# Altium schematic sheet 17.LPDDR4_LPDDR4x_1.SchDoc
size A4; SheetNumber: 17; SheetTotal: 21
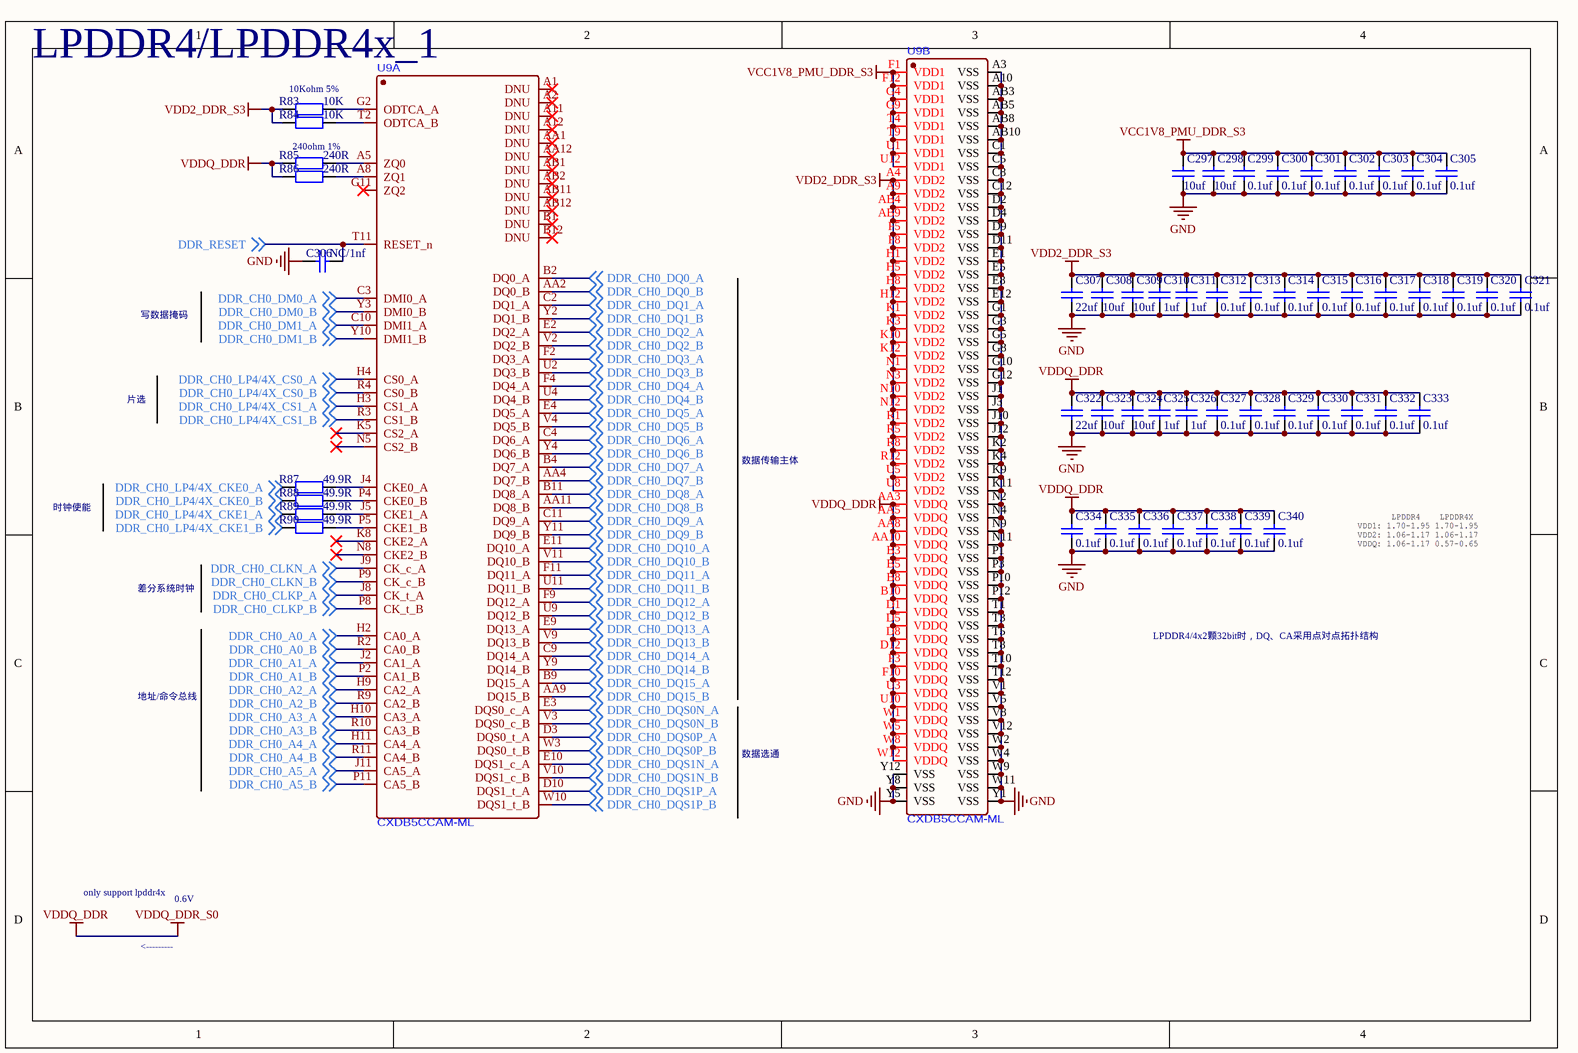
[diagram p0: 17.LPDDR4_LPDDR4x_1.SchDoc]

## Parts
C297  10uf  [C0402_L]
C298  10uf  [C0402_L]
C299  0.1uf  [C0201_L]
C300  0.1uf  [C0201_L]
C301  0.1uf  [C0201_L]
C302  0.1uf  [C0201_L]
C303  0.1uf  [C0201_L]
C304  0.1uf  [C0201_L]
C305  0.1uf  [C0201_L]
C306  NC/1nf  [C0201_L]
C307  22uf  [C0603_L]
C308  10uf  [C0402_L]
C309  10uf  [C0402_L]
C310  1uf  [C0201_L]
C311  1uf  [C0201_L]
C312  0.1uf  [C0201_L]
C313  0.1uf  [C0201_L]
C314  0.1uf  [C0201_L]
C315  0.1uf  [C0201_L]
C316  0.1uf  [C0201_L]
C317  0.1uf  [C0201_L]
C318  0.1uf  [C0201_L]
C319  0.1uf  [C0201_L]
C320  0.1uf  [C0201_L]
C321  0.1uf  [C0201_L]
C322  22uf  [C0603_L]
C323  10uf  [C0402_L]
C324  10uf  [C0402_L]
C325  1uf  [C0201_L]
C326  1uf  [C0201_L]
C327  0.1uf  [C0201_L]
C328  0.1uf  [C0201_L]
C329  0.1uf  [C0201_L]
C330  0.1uf  [C0201_L]
C331  0.1uf  [C0201_L]
C332  0.1uf  [C0201_L]
C333  0.1uf  [C0201_L]
C334  0.1uf  [C0201_L]
C335  0.1uf  [C0201_L]
C336  0.1uf  [C0201_L]
C337  0.1uf  [C0201_L]
C338  0.1uf  [C0201_L]
C339  0.1uf  [C0201_L]
C340  0.1uf  [C0201_L]
R83  10K  [R0201_L]
R84  10K  [R0201_L]
R85  240R  [R0201_L]
R86  240R  [R0201_L]
R87  49.9R  [R0201_L]
R88  49.9R  [R0201_L]
R89  49.9R  [R0201_L]
R90  49.9R  [R0201_L]
U9  CXDB5CCAM-ML  [FBGA-200_L15.0-W10.0-BL_K4F6E3S4HM]  (parts A,B of 2)

## Nets
GND: C297.1 C298.1 C299.1 C300.1 C301.1 C302.1 C303.1 C304.1 C305.1 C306.1 C307.1 C308.1 C309.1 C310.1 C311.1 C312.1 C313.1 C314.1 C315.1 C316.1 C317.1 C318.1 C319.1 C320.1 C321.1 C322.1 C323.1 C324.1 C325.1 C326.1 C327.1 C328.1 C329.1 C330.1 C331.1 C332.1 C333.1 C334.1 C335.1 C336.1 C337.1 C338.1 C339.1 C340.1 U9.A3(VSS) U9.A10(VSS) U9.AB3(VSS) U9.AB5(VSS) U9.AB8(VSS) U9.AB10(VSS) U9.C1(VSS) U9.C5(VSS) U9.C8(VSS) U9.C12(VSS) U9.D2(VSS) U9.D4(VSS) U9.D9(VSS) U9.D11(VSS) U9.E1(VSS) U9.E5(VSS) U9.E8(VSS) U9.E12(VSS) U9.G1(VSS) U9.G3(VSS) U9.G5(VSS) U9.G8(VSS) U9.G10(VSS) U9.G12(VSS) U9.J1(VSS) U9.J3(VSS) U9.J10(VSS) U9.J12(VSS) U9.K2(VSS) U9.K4(VSS) U9.K9(VSS) U9.K11(VSS) U9.N2(VSS) U9.N4(VSS) U9.N9(VSS) U9.N11(VSS) U9.P1(VSS) U9.P3(VSS) U9.P10(VSS) U9.P12(VSS) U9.T1(VSS) U9.T3(VSS) U9.T5(VSS) U9.T8(VSS) U9.T10(VSS) U9.T12(VSS) U9.V1(VSS) U9.V5(VSS) U9.V8(VSS) U9.V12(VSS) U9.W2(VSS) U9.W4(VSS) U9.W9(VSS) U9.W11(VSS) U9.Y1(VSS) U9.Y5(VSS) U9.Y8(VSS) U9.Y12(VSS)
VCC1V8_PMU_DDR_S3: C297.2 C298.2 C299.2 C300.2 C301.2 C302.2 C303.2 C304.2 C305.2 U9.F1(VDD1) U9.F12(VDD1) U9.G4(VDD1) U9.G9(VDD1) U9.T4(VDD1) U9.T9(VDD1) U9.U1(VDD1) U9.U12(VDD1)
VDD2_DDR_S3: C307.2 C308.2 C309.2 C310.2 C311.2 C312.2 C313.2 C314.2 C315.2 C316.2 C317.2 C318.2 C319.2 C320.2 C321.2 R83.1 R84.1 U9.A4(VDD2) U9.A9(VDD2) U9.AB4(VDD2) U9.AB9(VDD2) U9.F5(VDD2) U9.F8(VDD2) U9.H1(VDD2) U9.H5(VDD2) U9.H8(VDD2) U9.H12(VDD2) U9.K1(VDD2) U9.K3(VDD2) U9.K10(VDD2) U9.K12(VDD2) U9.N1(VDD2) U9.N3(VDD2) U9.N10(VDD2) U9.N12(VDD2) U9.R1(VDD2) U9.R5(VDD2) U9.R8(VDD2) U9.R12(VDD2) U9.U5(VDD2) U9.U8(VDD2)
VDDQ_DDR: C322.2 C323.2 C324.2 C325.2 C326.2 C327.2 C328.2 C329.2 C330.2 C331.2 C332.2 C333.2 C334.2 C335.2 C336.2 C337.2 C338.2 C339.2 C340.2 R85.1 R86.1 U9.AA3(VDDQ) U9.AA5(VDDQ) U9.AA8(VDDQ) U9.AA10(VDDQ) U9.B3(VDDQ) U9.B5(VDDQ) U9.B8(VDDQ) U9.B10(VDDQ) U9.D1(VDDQ) U9.D5(VDDQ) U9.D8(VDDQ) U9.D12(VDDQ) U9.F3(VDDQ) U9.F10(VDDQ) U9.U3(VDDQ) U9.U10(VDDQ) U9.W1(VDDQ) U9.W5(VDDQ) U9.W8(VDDQ) U9.W12(VDDQ)  [also labelled VDDQ_DDR_S0]
DDR_CH0_A0_A: U9.H2(CA0_A) ; off-sheet DDR_CH0_A0_A
DDR_CH0_A0_B: U9.R2(CA0_B) ; off-sheet DDR_CH0_A0_B
DDR_CH0_A1_A: U9.J2(CA1_A) ; off-sheet DDR_CH0_A1_A
DDR_CH0_A1_B: U9.P2(CA1_B) ; off-sheet DDR_CH0_A1_B
DDR_CH0_A2_A: U9.H9(CA2_A) ; off-sheet DDR_CH0_A2_A
DDR_CH0_A2_B: U9.R9(CA2_B) ; off-sheet DDR_CH0_A2_B
DDR_CH0_A3_A: U9.H10(CA3_A) ; off-sheet DDR_CH0_A3_A
DDR_CH0_A3_B: U9.R10(CA3_B) ; off-sheet DDR_CH0_A3_B
DDR_CH0_A4_A: U9.H11(CA4_A) ; off-sheet DDR_CH0_A4_A
DDR_CH0_A4_B: U9.R11(CA4_B) ; off-sheet DDR_CH0_A4_B
DDR_CH0_A5_A: U9.J11(CA5_A) ; off-sheet DDR_CH0_A5_A
DDR_CH0_A5_B: U9.P11(CA5_B) ; off-sheet DDR_CH0_A5_B
DDR_CH0_CLKN_A: U9.J9(CK_c_A) ; off-sheet DDR_CH0_CLKN_A
DDR_CH0_CLKN_B: U9.P9(CK_c_B) ; off-sheet DDR_CH0_CLKN_B
DDR_CH0_CLKP_A: U9.J8(CK_t_A) ; off-sheet DDR_CH0_CLKP_A
DDR_CH0_CLKP_B: U9.P8(CK_t_B) ; off-sheet DDR_CH0_CLKP_B
DDR_CH0_DM0_A: U9.C3(DMI0_A) ; off-sheet DDR_CH0_DM0_A
DDR_CH0_DM0_B: U9.Y3(DMI0_B) ; off-sheet DDR_CH0_DM0_B
DDR_CH0_DM1_A: U9.C10(DMI1_A) ; off-sheet DDR_CH0_DM1_A
DDR_CH0_DM1_B: U9.Y10(DMI1_B) ; off-sheet DDR_CH0_DM1_B
DDR_CH0_DQ0_A: U9.B2(DQ0_A) ; off-sheet DDR_CH0_DQ0_A
DDR_CH0_DQ0_B: U9.AA2(DQ0_B) ; off-sheet DDR_CH0_DQ0_B
DDR_CH0_DQ1_A: U9.C2(DQ1_A) ; off-sheet DDR_CH0_DQ1_A
DDR_CH0_DQ1_B: U9.Y2(DQ1_B) ; off-sheet DDR_CH0_DQ1_B
DDR_CH0_DQ2_A: U9.E2(DQ2_A) ; off-sheet DDR_CH0_DQ2_A
DDR_CH0_DQ2_B: U9.V2(DQ2_B) ; off-sheet DDR_CH0_DQ2_B
DDR_CH0_DQ3_A: U9.F2(DQ3_A) ; off-sheet DDR_CH0_DQ3_A
DDR_CH0_DQ3_B: U9.U2(DQ3_B) ; off-sheet DDR_CH0_DQ3_B
DDR_CH0_DQ4_A: U9.F4(DQ4_A) ; off-sheet DDR_CH0_DQ4_A
DDR_CH0_DQ4_B: U9.U4(DQ4_B) ; off-sheet DDR_CH0_DQ4_B
DDR_CH0_DQ5_A: U9.E4(DQ5_A) ; off-sheet DDR_CH0_DQ5_A
DDR_CH0_DQ5_B: U9.V4(DQ5_B) ; off-sheet DDR_CH0_DQ5_B
DDR_CH0_DQ6_A: U9.C4(DQ6_A) ; off-sheet DDR_CH0_DQ6_A
DDR_CH0_DQ6_B: U9.Y4(DQ6_B) ; off-sheet DDR_CH0_DQ6_B
DDR_CH0_DQ7_A: U9.B4(DQ7_A) ; off-sheet DDR_CH0_DQ7_A
DDR_CH0_DQ7_B: U9.AA4(DQ7_B) ; off-sheet DDR_CH0_DQ7_B
DDR_CH0_DQ8_A: U9.B11(DQ8_A) ; off-sheet DDR_CH0_DQ8_A
DDR_CH0_DQ8_B: U9.AA11(DQ8_B) ; off-sheet DDR_CH0_DQ8_B
DDR_CH0_DQ9_A: U9.C11(DQ9_A) ; off-sheet DDR_CH0_DQ9_A
DDR_CH0_DQ9_B: U9.Y11(DQ9_B) ; off-sheet DDR_CH0_DQ9_B
DDR_CH0_DQ10_A: U9.E11(DQ10_A) ; off-sheet DDR_CH0_DQ10_A
DDR_CH0_DQ10_B: U9.V11(DQ10_B) ; off-sheet DDR_CH0_DQ10_B
DDR_CH0_DQ11_A: U9.F11(DQ11_A) ; off-sheet DDR_CH0_DQ11_A
DDR_CH0_DQ11_B: U9.U11(DQ11_B) ; off-sheet DDR_CH0_DQ11_B
DDR_CH0_DQ12_A: U9.F9(DQ12_A) ; off-sheet DDR_CH0_DQ12_A
DDR_CH0_DQ12_B: U9.U9(DQ12_B) ; off-sheet DDR_CH0_DQ12_B
DDR_CH0_DQ13_A: U9.E9(DQ13_A) ; off-sheet DDR_CH0_DQ13_A
DDR_CH0_DQ13_B: U9.V9(DQ13_B) ; off-sheet DDR_CH0_DQ13_B
DDR_CH0_DQ14_A: U9.C9(DQ14_A) ; off-sheet DDR_CH0_DQ14_A
DDR_CH0_DQ14_B: U9.Y9(DQ14_B) ; off-sheet DDR_CH0_DQ14_B
DDR_CH0_DQ15_A: U9.B9(DQ15_A) ; off-sheet DDR_CH0_DQ15_A
DDR_CH0_DQ15_B: U9.AA9(DQ15_B) ; off-sheet DDR_CH0_DQ15_B
DDR_CH0_DQS0N_A: U9.E3(DQS0_c_A) ; off-sheet DDR_CH0_DQS0N_A
DDR_CH0_DQS0N_B: U9.V3(DQS0_c_B) ; off-sheet DDR_CH0_DQS0N_B
DDR_CH0_DQS0P_A: U9.D3(DQS0_t_A) ; off-sheet DDR_CH0_DQS0P_A
DDR_CH0_DQS0P_B: U9.W3(DQS0_t_B) ; off-sheet DDR_CH0_DQS0P_B
DDR_CH0_DQS1N_A: U9.E10(DQS1_c_A) ; off-sheet DDR_CH0_DQS1N_A
DDR_CH0_DQS1N_B: U9.V10(DQS1_c_B) ; off-sheet DDR_CH0_DQS1N_B
DDR_CH0_DQS1P_A: U9.D10(DQS1_t_A) ; off-sheet DDR_CH0_DQS1P_A
DDR_CH0_DQS1P_B: U9.W10(DQS1_t_B) ; off-sheet DDR_CH0_DQS1P_B
DDR_CH0_LP4/4X_CKE0_A: R87.1 ; off-sheet DDR_CH0_LP4/4X_CKE0_A
DDR_CH0_LP4/4X_CKE0_B: R88.1 ; off-sheet DDR_CH0_LP4/4X_CKE0_B
DDR_CH0_LP4/4X_CKE1_A: R89.1 ; off-sheet DDR_CH0_LP4/4X_CKE1_A
DDR_CH0_LP4/4X_CKE1_B: R90.1 ; off-sheet DDR_CH0_LP4/4X_CKE1_B
DDR_CH0_LP4/4X_CS0_A: U9.H4(CS0_A) ; off-sheet DDR_CH0_LP4/4X_CS0_A
DDR_CH0_LP4/4X_CS0_B: U9.R4(CS0_B) ; off-sheet DDR_CH0_LP4/4X_CS0_B
DDR_CH0_LP4/4X_CS1_A: U9.H3(CS1_A) ; off-sheet DDR_CH0_LP4/4X_CS1_A
DDR_CH0_LP4/4X_CS1_B: U9.R3(CS1_B) ; off-sheet DDR_CH0_LP4/4X_CS1_B
DDR_RESET: C306.2 U9.T11(RESET_n) ; off-sheet DDR_RESET
NetR83_2: R83.2 U9.G2(ODTCA_A)
NetR84_2: R84.2 U9.T2(ODTCA_B)
NetR85_2: R85.2 U9.A5(ZQ0)
NetR86_2: R86.2 U9.A8(ZQ1)
NetR87_2: R87.2 U9.J4(CKE0_A)
NetR88_2: R88.2 U9.P4(CKE0_B)
NetR89_2: R89.2 U9.J5(CKE1_A)
NetR90_2: R90.2 U9.P5(CKE1_B)

Not connected (* = marked no-connect by the designer): U9 A1(DNU)* A2(DNU)* A11(DNU)* A12(DNU)* AA1(DNU)* AA12(DNU)* AB1(DNU)* AB2(DNU)* AB11(DNU)* AB12(DNU)* B1(DNU)* B12(DNU)* G11(ZQ2)* K5(CS2_A)* K8(CKE2_A)* N5(CS2_B)* N8(CKE2_B)*

## Notes on the sheet
- (near U9) LPDDR4/LPDDR4x_1
- (near R83) 10Kohm 5%
- (near R85) 240ohm 1%
- 写数据掩码
- 片选
- 数据传输主体
- 时钟使能
- 差分系统时钟
- LPDDR4/4x2颗32bit时，DQ、CA采用点对点拓扑结构
- 地址/命令总线
- 数据选通
- only support lpddr4x
- 0.6V
- <---------

## Library data of the parts
C297-C340 = C: 贴片电容/MLCC电容
R83-R90 = R: 贴片电阻